# Altium schematic sheet Uart.SchDoc
size A4
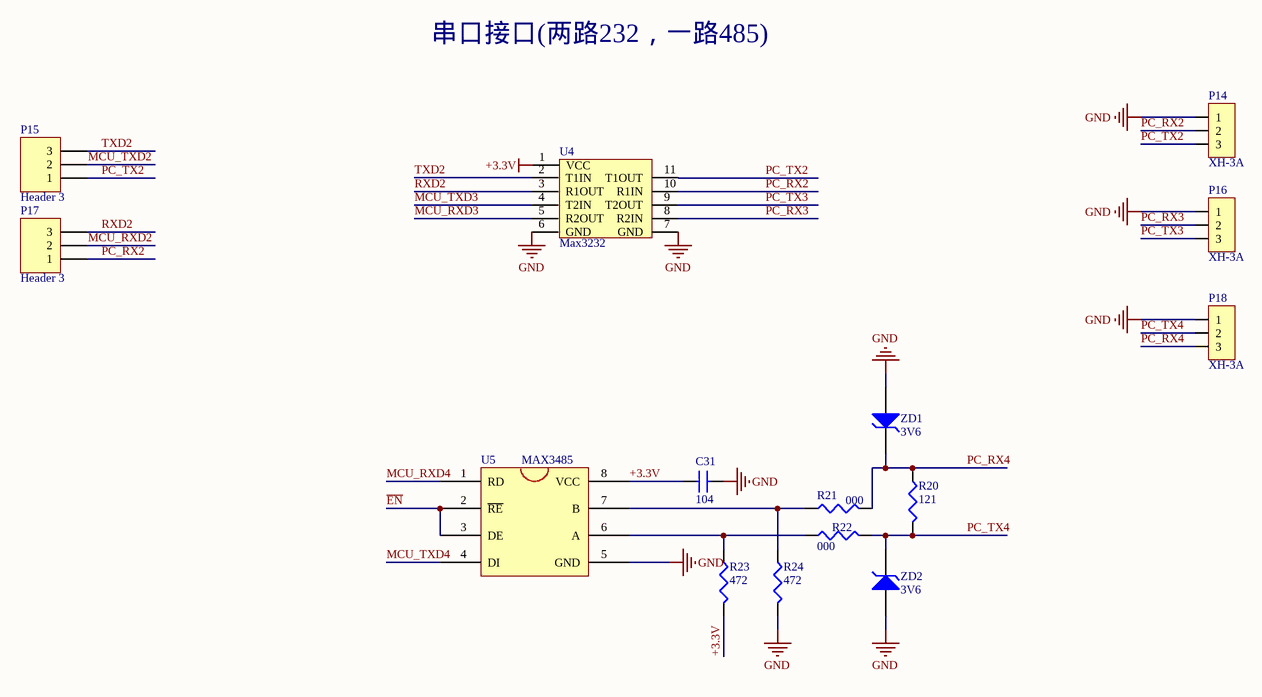
[diagram p0: Uart.SchDoc]

## Parts
C31  104  [0603C]
P14  XH-3A  [CN3-2.54]
P15  Header 3  [HDR1X3]
P16  XH-3A  [CN3-2.54]
P17  Header 3  [HDR1X3]
P18  XH-3A  [CN3-2.54]
R20  121  [0603R]
R21  000  [0603R]
R22  000  [0603R]
R23  472  [0603R]
R24  472  [0603R]
U4  Max3232  [Community V01]
U5  MAX3485  [SOP8]
ZD1  3V6  [SMA For SML4729A]
ZD2  3V6  [SMA For SML4729A]

## Nets
+3.3V: C31.1 R23.2 U4.1(VCC) U5.8(VCC)
GND: C31.2 P14.1 P16.1 P18.1 R24.2 U4.6(GND) U4.7(GND) U5.5(GND) ZD1.1 ZD2.1
~{EN}: U5.2(~{RE}) U5.3(DE)
MCU_RXD2: P17.2
MCU_RXD3: U4.5(R2OUT)
MCU_RXD4: U5.1(RD)
MCU_TXD2: P15.2
MCU_TXD3: U4.4(T2IN)
MCU_TXD4: U5.4(DI)
PC_RX2: P14.2 P17.1 U4.10(R1IN)
PC_RX3: P16.2 U4.8(R2IN)
PC_RX4: P18.3 R20.1 R21.2 ZD1.2
PC_TX2: P14.3 P15.1 U4.11(T1OUT)
PC_TX3: P16.3 U4.9(T2OUT)
PC_TX4: P18.2 R20.2 R22.2 ZD2.2
RXD2: P17.3 U4.3(R1OUT)
TXD2: P15.3 U4.2(T1IN)
NetR21_1: R21.1 R24.1 U5.7(B)
NetR22_1: R22.1 R23.1 U5.6(A)

## Notes on the sheet
- 串口接口(两路232，一路485)

## Library data of the parts
C31 = 电容: Capacitor; Value: 104
P14 P16 P18 = CONN-XH-3A: CONN,XH-3A,3PIN,2.54mm插座; 料号: 10701-00004-00; 品名: 线对板连接器
P15 P17 = Header 3: Header, 3-Pin; LatestRevisionDate: 17-Jul-2002; LatestRevisionNote: Re-released for DXP Platform.; Publisher: Altium Limited
R20-R24 = RES1
U4 = Community V01
U5 = MAX485
ZD1 ZD2 = 稳压二极管: constant diode